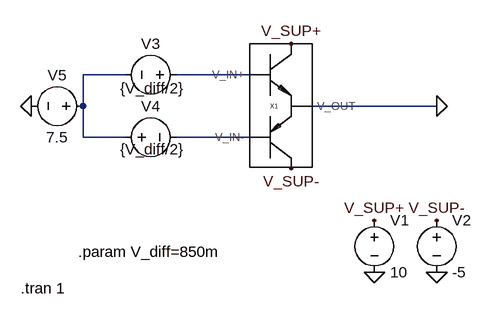
[diagram p0: schematic sim_outstage_currentlimit.asc]
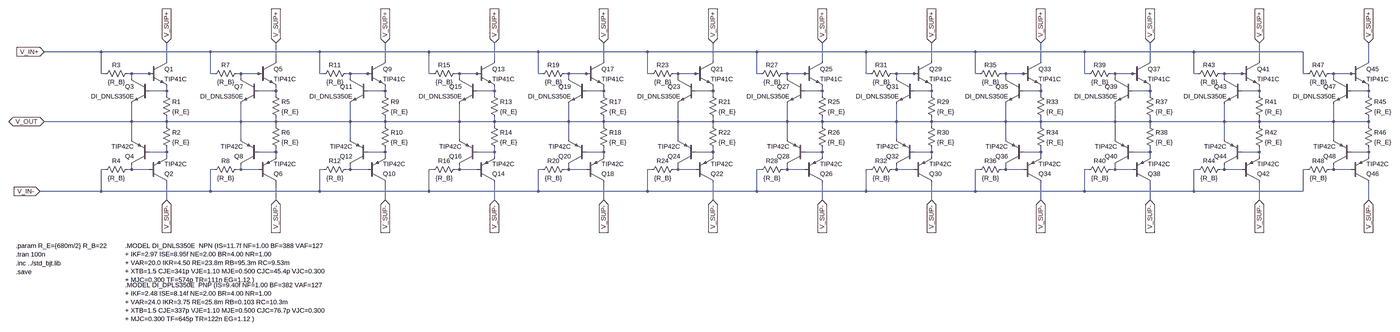
[diagram p1: sub-circuit outstage.asc, whole sheet]
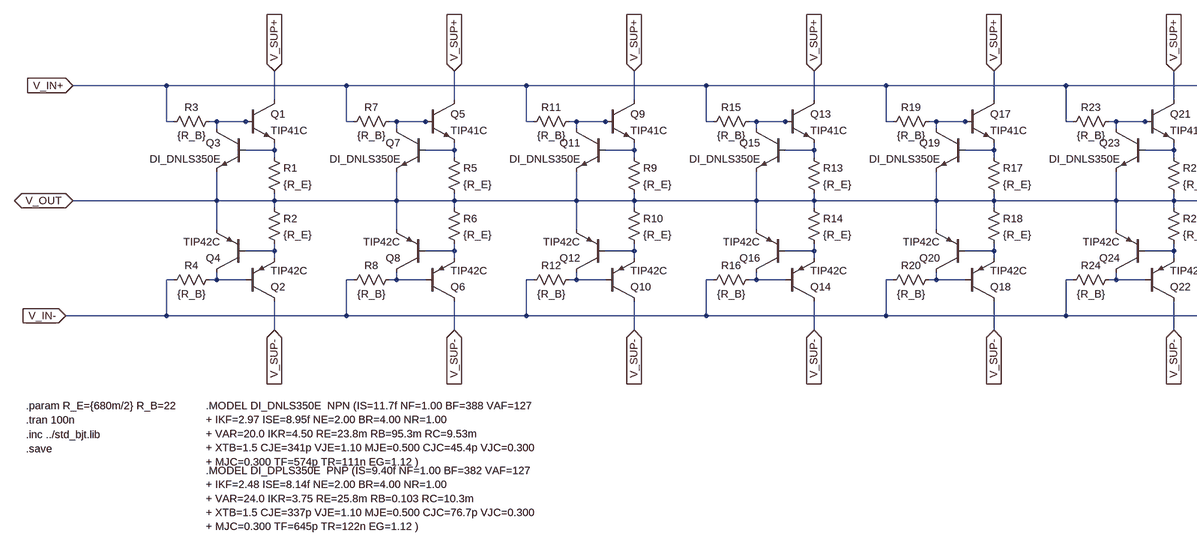
[diagram p2: sub-circuit outstage.asc, part, row 1 of 1, column 1 of 2]
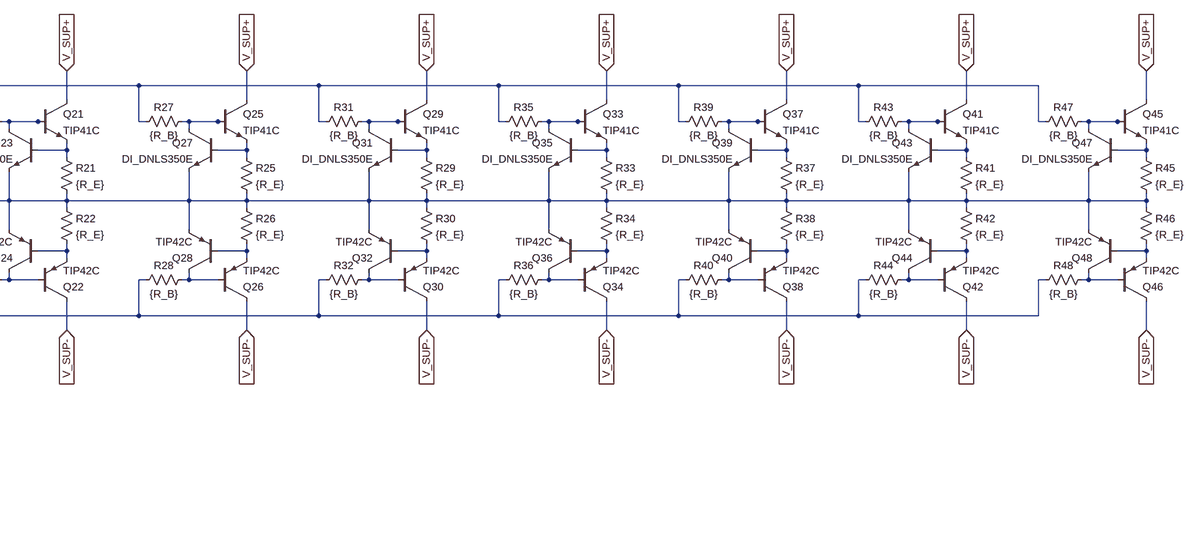
[diagram p3: sub-circuit outstage.asc, part, row 1 of 1, column 2 of 2]
sim_outstage_currentlimit.asc, the LTspice schematic file:
Version 4
SHEET 1 880 680
WIRE -64 112 -128 112
WIRE 128 112 16 112
WIRE -128 160 -128 112
WIRE 416 160 224 160
WIRE -128 208 -128 160
WIRE -64 208 -128 208
WIRE 128 208 16 208
FLAG 320 416 0
FLAG 416 416 0
FLAG 320 336 V_SUP+
FLAG 416 336 V_SUP-
FLAG 192 64 V_SUP+
FLAG 192 256 V_SUP-
FLAG -208 160 0
FLAG 416 160 0
SYMBOL outstage 160 160 R0
WINDOW 0 0 0 Left 0
SYMATTR InstName X1
SYMBOL voltage 320 320 R0
WINDOW 123 0 0 Left 0
WINDOW 39 0 0 Left 0
SYMATTR InstName V1
SYMATTR Value 10
SYMBOL voltage 416 320 R0
WINDOW 123 0 0 Left 0
WINDOW 39 0 0 Left 0
SYMATTR InstName V2
SYMATTR Value -5
SYMBOL voltage 32 112 R90
WINDOW 0 -32 56 VBottom 2
WINDOW 3 5 54 VTop 2
WINDOW 123 0 0 Left 0
WINDOW 39 0 0 Left 0
SYMATTR InstName V3
SYMATTR Value {V_diff/2}
SYMBOL voltage -80 208 R270
WINDOW 0 32 56 VTop 2
WINDOW 3 -3 58 VBottom 2
WINDOW 123 0 0 Left 0
WINDOW 39 0 0 Left 0
SYMATTR InstName V4
SYMATTR Value {V_diff/2}
SYMBOL voltage -112 160 R90
WINDOW 0 -32 56 VBottom 2
WINDOW 3 32 56 VTop 2
WINDOW 123 0 0 Left 0
WINDOW 39 0 0 Left 0
SYMATTR InstName V5
SYMATTR Value 7.5
TEXT -136 384 Left 2 !.param V_diff=850m
TEXT -224 440 Left 2 !.tran 1

outstage.asc, the sub-circuit schematic file:
Version 4
SHEET 1 5688 824
WIRE -80 -160 -288 -160
WIRE 320 -160 -80 -160
WIRE 720 -160 320 -160
WIRE 1120 -160 720 -160
WIRE 1520 -160 1120 -160
WIRE 1920 -160 1520 -160
WIRE 2320 -160 1920 -160
WIRE 2720 -160 2320 -160
WIRE 3120 -160 2720 -160
WIRE 3520 -160 3120 -160
WIRE 3920 -160 3520 -160
WIRE 4320 -160 3920 -160
WIRE 160 -128 160 -192
WIRE 560 -128 560 -192
WIRE 960 -128 960 -192
WIRE 1360 -128 1360 -192
WIRE 1760 -128 1760 -192
WIRE 2160 -128 2160 -192
WIRE 2560 -128 2560 -192
WIRE 2960 -128 2960 -192
WIRE 3360 -128 3360 -192
WIRE 3760 -128 3760 -192
WIRE 4160 -128 4160 -192
WIRE 4560 -128 4560 -192
WIRE -80 -80 -80 -160
WIRE -64 -80 -80 -80
WIRE 32 -80 16 -80
WIRE 96 -80 32 -80
WIRE 112 -80 96 -80
WIRE 320 -80 320 -160
WIRE 336 -80 320 -80
WIRE 432 -80 416 -80
WIRE 496 -80 432 -80
WIRE 512 -80 496 -80
WIRE 720 -80 720 -160
WIRE 736 -80 720 -80
WIRE 832 -80 816 -80
WIRE 896 -80 832 -80
WIRE 912 -80 896 -80
WIRE 1120 -80 1120 -160
WIRE 1136 -80 1120 -80
WIRE 1232 -80 1216 -80
WIRE 1296 -80 1232 -80
WIRE 1312 -80 1296 -80
WIRE 1520 -80 1520 -160
WIRE 1536 -80 1520 -80
WIRE 1632 -80 1616 -80
WIRE 1696 -80 1632 -80
WIRE 1712 -80 1696 -80
WIRE 1920 -80 1920 -160
WIRE 1936 -80 1920 -80
WIRE 2032 -80 2016 -80
WIRE 2096 -80 2032 -80
WIRE 2112 -80 2096 -80
WIRE 2320 -80 2320 -160
WIRE 2336 -80 2320 -80
WIRE 2432 -80 2416 -80
WIRE 2496 -80 2432 -80
WIRE 2512 -80 2496 -80
WIRE 2720 -80 2720 -160
WIRE 2736 -80 2720 -80
WIRE 2832 -80 2816 -80
WIRE 2896 -80 2832 -80
WIRE 2912 -80 2896 -80
WIRE 3120 -80 3120 -160
WIRE 3136 -80 3120 -80
WIRE 3232 -80 3216 -80
WIRE 3296 -80 3232 -80
WIRE 3312 -80 3296 -80
WIRE 3520 -80 3520 -160
WIRE 3536 -80 3520 -80
WIRE 3632 -80 3616 -80
WIRE 3696 -80 3632 -80
WIRE 3712 -80 3696 -80
WIRE 3920 -80 3920 -160
WIRE 3936 -80 3920 -80
WIRE 4032 -80 4016 -80
WIRE 4096 -80 4032 -80
WIRE 4112 -80 4096 -80
WIRE 4320 -80 4320 -160
WIRE 4336 -80 4320 -80
WIRE 4432 -80 4416 -80
WIRE 4496 -80 4432 -80
WIRE 4512 -80 4496 -80
WIRE 32 -64 32 -80
WIRE 432 -64 432 -80
WIRE 832 -64 832 -80
WIRE 1232 -64 1232 -80
WIRE 1632 -64 1632 -80
WIRE 2032 -64 2032 -80
WIRE 2432 -64 2432 -80
WIRE 2832 -64 2832 -80
WIRE 3232 -64 3232 -80
WIRE 3632 -64 3632 -80
WIRE 4032 -64 4032 -80
WIRE 4432 -64 4432 -80
WIRE 160 -16 160 -32
WIRE 160 -16 96 -16
WIRE 560 -16 560 -32
WIRE 560 -16 496 -16
WIRE 960 -16 960 -32
WIRE 960 -16 896 -16
WIRE 1360 -16 1360 -32
WIRE 1360 -16 1296 -16
WIRE 1760 -16 1760 -32
WIRE 1760 -16 1696 -16
WIRE 2160 -16 2160 -32
WIRE 2160 -16 2096 -16
WIRE 2560 -16 2560 -32
WIRE 2560 -16 2496 -16
WIRE 2960 -16 2960 -32
WIRE 2960 -16 2896 -16
WIRE 3360 -16 3360 -32
WIRE 3360 -16 3296 -16
WIRE 3760 -16 3760 -32
WIRE 3760 -16 3696 -16
WIRE 4160 -16 4160 -32
WIRE 4160 -16 4096 -16
WIRE 4560 -16 4560 -32
WIRE 4560 -16 4496 -16
WIRE 160 0 160 -16
WIRE 560 0 560 -16
WIRE 960 0 960 -16
WIRE 1360 0 1360 -16
WIRE 1760 0 1760 -16
WIRE 2160 0 2160 -16
WIRE 2560 0 2560 -16
WIRE 2960 0 2960 -16
WIRE 3360 0 3360 -16
WIRE 3760 0 3760 -16
WIRE 4160 0 4160 -16
WIRE 4560 0 4560 -16
WIRE 32 96 32 32
WIRE 32 96 -288 96
WIRE 160 96 160 80
WIRE 160 96 32 96
WIRE 432 96 432 32
WIRE 432 96 160 96
WIRE 560 96 560 80
WIRE 560 96 432 96
WIRE 832 96 832 32
WIRE 832 96 560 96
WIRE 960 96 960 80
WIRE 960 96 832 96
WIRE 1232 96 1232 32
WIRE 1232 96 960 96
WIRE 1360 96 1360 80
WIRE 1360 96 1232 96
WIRE 1632 96 1632 32
WIRE 1632 96 1360 96
WIRE 1760 96 1760 80
WIRE 1760 96 1632 96
WIRE 2032 96 2032 32
WIRE 2032 96 1760 96
WIRE 2160 96 2160 80
WIRE 2160 96 2032 96
WIRE 2432 96 2432 32
WIRE 2432 96 2160 96
WIRE 2560 96 2560 80
WIRE 2560 96 2432 96
WIRE 2832 96 2832 32
WIRE 2832 96 2560 96
WIRE 2960 96 2960 80
WIRE 2960 96 2832 96
WIRE 3232 96 3232 32
WIRE 3232 96 2960 96
WIRE 3360 96 3360 80
WIRE 3360 96 3232 96
WIRE 3632 96 3632 32
WIRE 3632 96 3360 96
WIRE 3760 96 3760 80
WIRE 3760 96 3632 96
WIRE 4032 96 4032 32
WIRE 4032 96 3760 96
WIRE 4160 96 4160 80
WIRE 4160 96 4032 96
WIRE 4432 96 4432 32
WIRE 4432 96 4160 96
WIRE 4560 96 4560 80
WIRE 4560 96 4432 96
WIRE 160 112 160 96
WIRE 560 112 560 96
WIRE 960 112 960 96
WIRE 1360 112 1360 96
WIRE 1760 112 1760 96
WIRE 2160 112 2160 96
WIRE 2560 112 2560 96
WIRE 2960 112 2960 96
WIRE 3360 112 3360 96
WIRE 3760 112 3760 96
WIRE 4160 112 4160 96
WIRE 4560 112 4560 96
WIRE 32 160 32 96
WIRE 432 160 432 96
WIRE 832 160 832 96
WIRE 1232 160 1232 96
WIRE 1632 160 1632 96
WIRE 2032 160 2032 96
WIRE 2432 160 2432 96
WIRE 2832 160 2832 96
WIRE 3232 160 3232 96
WIRE 3632 160 3632 96
WIRE 4032 160 4032 96
WIRE 4432 160 4432 96
WIRE 160 208 160 192
WIRE 160 208 96 208
WIRE 560 208 560 192
WIRE 560 208 496 208
WIRE 960 208 960 192
WIRE 960 208 896 208
WIRE 1360 208 1360 192
WIRE 1360 208 1296 208
WIRE 1760 208 1760 192
WIRE 1760 208 1696 208
WIRE 2160 208 2160 192
WIRE 2160 208 2096 208
WIRE 2560 208 2560 192
WIRE 2560 208 2496 208
WIRE 2960 208 2960 192
WIRE 2960 208 2896 208
WIRE 3360 208 3360 192
WIRE 3360 208 3296 208
WIRE 3760 208 3760 192
WIRE 3760 208 3696 208
WIRE 4160 208 4160 192
WIRE 4160 208 4096 208
WIRE 4560 208 4560 192
WIRE 4560 208 4496 208
WIRE 160 224 160 208
WIRE 560 224 560 208
WIRE 960 224 960 208
WIRE 1360 224 1360 208
WIRE 1760 224 1760 208
WIRE 2160 224 2160 208
WIRE 2560 224 2560 208
WIRE 2960 224 2960 208
WIRE 3360 224 3360 208
WIRE 3760 224 3760 208
WIRE 4160 224 4160 208
WIRE 4560 224 4560 208
WIRE -64 272 -80 272
WIRE 32 272 32 256
WIRE 32 272 16 272
WIRE 96 272 32 272
WIRE 336 272 320 272
WIRE 432 272 432 256
WIRE 432 272 416 272
WIRE 496 272 432 272
WIRE 736 272 720 272
WIRE 832 272 832 256
WIRE 832 272 816 272
WIRE 896 272 832 272
WIRE 1136 272 1120 272
WIRE 1232 272 1232 256
WIRE 1232 272 1216 272
WIRE 1296 272 1232 272
WIRE 1536 272 1520 272
WIRE 1632 272 1632 256
WIRE 1632 272 1616 272
WIRE 1696 272 1632 272
WIRE 1936 272 1920 272
WIRE 2032 272 2032 256
WIRE 2032 272 2016 272
WIRE 2096 272 2032 272
WIRE 2336 272 2320 272
WIRE 2432 272 2432 256
WIRE 2432 272 2416 272
WIRE 2496 272 2432 272
WIRE 2736 272 2720 272
WIRE 2832 272 2832 256
WIRE 2832 272 2816 272
WIRE 2896 272 2832 272
WIRE 3136 272 3120 272
WIRE 3232 272 3232 256
WIRE 3232 272 3216 272
WIRE 3296 272 3232 272
WIRE 3536 272 3520 272
WIRE 3632 272 3632 256
WIRE 3632 272 3616 272
WIRE 3696 272 3632 272
WIRE 3936 272 3920 272
WIRE 4032 272 4032 256
WIRE 4032 272 4016 272
WIRE 4096 272 4032 272
WIRE 4336 272 4320 272
WIRE 4432 272 4432 256
WIRE 4432 272 4416 272
WIRE 4496 272 4432 272
WIRE -80 352 -80 272
WIRE -80 352 -304 352
WIRE 320 352 320 272
WIRE 320 352 -80 352
WIRE 720 352 720 272
WIRE 720 352 320 352
WIRE 1120 352 1120 272
WIRE 1120 352 720 352
WIRE 1520 352 1520 272
WIRE 1520 352 1120 352
WIRE 1920 352 1920 272
WIRE 1920 352 1520 352
WIRE 2320 352 2320 272
WIRE 2320 352 1920 352
WIRE 2720 352 2720 272
WIRE 2720 352 2320 352
WIRE 3120 352 3120 272
WIRE 3120 352 2720 352
WIRE 3520 352 3520 272
WIRE 3520 352 3120 352
WIRE 3920 352 3920 272
WIRE 3920 352 3520 352
WIRE 4320 352 4320 272
WIRE 4320 352 3920 352
WIRE 160 384 160 320
WIRE 560 384 560 320
WIRE 960 384 960 320
WIRE 1360 384 1360 320
WIRE 1760 384 1760 320
WIRE 2160 384 2160 320
WIRE 2560 384 2560 320
WIRE 2960 384 2960 320
WIRE 3360 384 3360 320
WIRE 3760 384 3760 320
WIRE 4160 384 4160 320
WIRE 4560 384 4560 320
FLAG 160 -192 V_SUP+
IOPIN 160 -192 In
FLAG 160 384 V_SUP-
IOPIN 160 384 In
FLAG -288 -160 V_IN+
IOPIN -288 -160 In
FLAG -304 352 V_IN-
IOPIN -304 352 In
FLAG -288 96 V_OUT
IOPIN -288 96 BiDir
FLAG 560 -192 V_SUP+
IOPIN 560 -192 In
FLAG 560 384 V_SUP-
IOPIN 560 384 In
FLAG 960 -192 V_SUP+
IOPIN 960 -192 In
FLAG 960 384 V_SUP-
IOPIN 960 384 In
FLAG 1360 -192 V_SUP+
IOPIN 1360 -192 In
FLAG 1360 384 V_SUP-
IOPIN 1360 384 In
FLAG 1760 -192 V_SUP+
IOPIN 1760 -192 In
FLAG 1760 384 V_SUP-
IOPIN 1760 384 In
FLAG 2160 -192 V_SUP+
IOPIN 2160 -192 In
FLAG 2160 384 V_SUP-
IOPIN 2160 384 In
FLAG 2560 -192 V_SUP+
IOPIN 2560 -192 In
FLAG 2560 384 V_SUP-
IOPIN 2560 384 In
FLAG 2960 -192 V_SUP+
IOPIN 2960 -192 In
FLAG 2960 384 V_SUP-
IOPIN 2960 384 In
FLAG 3360 -192 V_SUP+
IOPIN 3360 -192 In
FLAG 3360 384 V_SUP-
IOPIN 3360 384 In
FLAG 3760 -192 V_SUP+
IOPIN 3760 -192 In
FLAG 3760 384 V_SUP-
IOPIN 3760 384 In
FLAG 4160 -192 V_SUP+
IOPIN 4160 -192 In
FLAG 4160 384 V_SUP-
IOPIN 4160 384 In
FLAG 4560 -192 V_SUP+
IOPIN 4560 -192 In
FLAG 4560 384 V_SUP-
IOPIN 4560 384 In
SYMBOL npn 96 -128 R0
SYMATTR InstName Q1
SYMATTR Value TIP41C
SYMBOL pnp 96 320 M180
SYMATTR InstName Q2
SYMATTR Value TIP42C
SYMBOL res 144 -16 R0
SYMATTR InstName R1
SYMATTR Value {R_E}
SYMBOL res 144 96 R0
SYMATTR InstName R2
SYMATTR Value {R_E}
SYMBOL npn 96 -64 M0
SYMATTR InstName Q3
SYMATTR Value DI_DNLS350E
SYMBOL res 32 -96 R90
WINDOW 0 0 56 VBottom 2
WINDOW 3 32 56 VTop 2
SYMATTR InstName R3
SYMATTR Value {R_B}
SYMBOL pnp 96 256 R180
SYMATTR InstName Q4
SYMATTR Value TIP42C
SYMBOL res 32 256 R90
WINDOW 0 0 56 VBottom 2
WINDOW 3 32 56 VTop 2
SYMATTR InstName R4
SYMATTR Value {R_B}
SYMBOL npn 496 -128 R0
SYMATTR InstName Q5
SYMATTR Value TIP41C
SYMBOL pnp 496 320 M180
SYMATTR InstName Q6
SYMATTR Value TIP42C
SYMBOL res 544 -16 R0
SYMATTR InstName R5
SYMATTR Value {R_E}
SYMBOL res 544 96 R0
SYMATTR InstName R6
SYMATTR Value {R_E}
SYMBOL npn 496 -64 M0
SYMATTR InstName Q7
SYMATTR Value DI_DNLS350E
SYMBOL res 432 -96 R90
WINDOW 0 0 56 VBottom 2
WINDOW 3 32 56 VTop 2
SYMATTR InstName R7
SYMATTR Value {R_B}
SYMBOL pnp 496 256 R180
SYMATTR InstName Q8
SYMATTR Value TIP42C
SYMBOL res 432 256 R90
WINDOW 0 0 56 VBottom 2
WINDOW 3 32 56 VTop 2
SYMATTR InstName R8
SYMATTR Value {R_B}
SYMBOL npn 896 -128 R0
SYMATTR InstName Q9
SYMATTR Value TIP41C
SYMBOL pnp 896 320 M180
SYMATTR InstName Q10
SYMATTR Value TIP42C
SYMBOL res 944 -16 R0
SYMATTR InstName R9
SYMATTR Value {R_E}
SYMBOL res 944 96 R0
SYMATTR InstName R10
SYMATTR Value {R_E}
SYMBOL npn 896 -64 M0
SYMATTR InstName Q11
SYMATTR Value DI_DNLS350E
SYMBOL res 832 -96 R90
WINDOW 0 0 56 VBottom 2
WINDOW 3 32 56 VTop 2
SYMATTR InstName R11
SYMATTR Value {R_B}
SYMBOL pnp 896 256 R180
SYMATTR InstName Q12
SYMATTR Value TIP42C
SYMBOL res 832 256 R90
WINDOW 0 0 56 VBottom 2
WINDOW 3 32 56 VTop 2
SYMATTR InstName R12
SYMATTR Value {R_B}
SYMBOL npn 1296 -128 R0
SYMATTR InstName Q13
SYMATTR Value TIP41C
SYMBOL pnp 1296 320 M180
SYMATTR InstName Q14
SYMATTR Value TIP42C
SYMBOL res 1344 -16 R0
SYMATTR InstName R13
SYMATTR Value {R_E}
SYMBOL res 1344 96 R0
SYMATTR InstName R14
SYMATTR Value {R_E}
SYMBOL npn 1296 -64 M0
SYMATTR InstName Q15
SYMATTR Value DI_DNLS350E
SYMBOL res 1232 -96 R90
WINDOW 0 0 56 VBottom 2
WINDOW 3 32 56 VTop 2
SYMATTR InstName R15
SYMATTR Value {R_B}
SYMBOL pnp 1296 256 R180
SYMATTR InstName Q16
SYMATTR Value TIP42C
SYMBOL res 1232 256 R90
WINDOW 0 0 56 VBottom 2
WINDOW 3 32 56 VTop 2
SYMATTR InstName R16
SYMATTR Value {R_B}
SYMBOL npn 1696 -128 R0
SYMATTR InstName Q17
SYMATTR Value TIP41C
SYMBOL pnp 1696 320 M180
SYMATTR InstName Q18
SYMATTR Value TIP42C
SYMBOL res 1744 -16 R0
SYMATTR InstName R17
SYMATTR Value {R_E}
SYMBOL res 1744 96 R0
SYMATTR InstName R18
SYMATTR Value {R_E}
SYMBOL npn 1696 -64 M0
SYMATTR InstName Q19
SYMATTR Value DI_DNLS350E
SYMBOL res 1632 -96 R90
WINDOW 0 0 56 VBottom 2
WINDOW 3 32 56 VTop 2
SYMATTR InstName R19
SYMATTR Value {R_B}
SYMBOL pnp 1696 256 R180
SYMATTR InstName Q20
SYMATTR Value TIP42C
SYMBOL res 1632 256 R90
WINDOW 0 0 56 VBottom 2
WINDOW 3 32 56 VTop 2
SYMATTR InstName R20
SYMATTR Value {R_B}
SYMBOL npn 2096 -128 R0
SYMATTR InstName Q21
SYMATTR Value TIP41C
SYMBOL pnp 2096 320 M180
SYMATTR InstName Q22
SYMATTR Value TIP42C
SYMBOL res 2144 -16 R0
SYMATTR InstName R21
SYMATTR Value {R_E}
SYMBOL res 2144 96 R0
SYMATTR InstName R22
SYMATTR Value {R_E}
SYMBOL npn 2096 -64 M0
SYMATTR InstName Q23
SYMATTR Value DI_DNLS350E
SYMBOL res 2032 -96 R90
WINDOW 0 0 56 VBottom 2
WINDOW 3 32 56 VTop 2
SYMATTR InstName R23
SYMATTR Value {R_B}
SYMBOL pnp 2096 256 R180
SYMATTR InstName Q24
SYMATTR Value TIP42C
SYMBOL res 2032 256 R90
WINDOW 0 0 56 VBottom 2
WINDOW 3 32 56 VTop 2
SYMATTR InstName R24
SYMATTR Value {R_B}
SYMBOL npn 2496 -128 R0
SYMATTR InstName Q25
SYMATTR Value TIP41C
SYMBOL pnp 2496 320 M180
SYMATTR InstName Q26
SYMATTR Value TIP42C
SYMBOL res 2544 -16 R0
SYMATTR InstName R25
SYMATTR Value {R_E}
SYMBOL res 2544 96 R0
SYMATTR InstName R26
SYMATTR Value {R_E}
SYMBOL npn 2496 -64 M0
SYMATTR InstName Q27
SYMATTR Value DI_DNLS350E
SYMBOL res 2432 -96 R90
WINDOW 0 0 56 VBottom 2
WINDOW 3 32 56 VTop 2
SYMATTR InstName R27
SYMATTR Value {R_B}
SYMBOL pnp 2496 256 R180
SYMATTR InstName Q28
SYMATTR Value TIP42C
SYMBOL res 2432 256 R90
WINDOW 0 0 56 VBottom 2
WINDOW 3 32 56 VTop 2
SYMATTR InstName R28
SYMATTR Value {R_B}
SYMBOL npn 2896 -128 R0
SYMATTR InstName Q29
SYMATTR Value TIP41C
SYMBOL pnp 2896 320 M180
SYMATTR InstName Q30
SYMATTR Value TIP42C
SYMBOL res 2944 -16 R0
SYMATTR InstName R29
SYMATTR Value {R_E}
SYMBOL res 2944 96 R0
SYMATTR InstName R30
SYMATTR Value {R_E}
SYMBOL npn 2896 -64 M0
SYMATTR InstName Q31
SYMATTR Value DI_DNLS350E
SYMBOL res 2832 -96 R90
WINDOW 0 0 56 VBottom 2
WINDOW 3 32 56 VTop 2
SYMATTR InstName R31
SYMATTR Value {R_B}
SYMBOL pnp 2896 256 R180
SYMATTR InstName Q32
SYMATTR Value TIP42C
SYMBOL res 2832 256 R90
WINDOW 0 0 56 VBottom 2
WINDOW 3 32 56 VTop 2
SYMATTR InstName R32
SYMATTR Value {R_B}
SYMBOL npn 3296 -128 R0
SYMATTR InstName Q33
SYMATTR Value TIP41C
SYMBOL pnp 3296 320 M180
SYMATTR InstName Q34
SYMATTR Value TIP42C
SYMBOL res 3344 -16 R0
SYMATTR InstName R33
SYMATTR Value {R_E}
SYMBOL res 3344 96 R0
SYMATTR InstName R34
SYMATTR Value {R_E}
SYMBOL npn 3296 -64 M0
SYMATTR InstName Q35
SYMATTR Value DI_DNLS350E
SYMBOL res 3232 -96 R90
WINDOW 0 0 56 VBottom 2
WINDOW 3 32 56 VTop 2
SYMATTR InstName R35
SYMATTR Value {R_B}
SYMBOL pnp 3296 256 R180
SYMATTR InstName Q36
SYMATTR Value TIP42C
SYMBOL res 3232 256 R90
WINDOW 0 0 56 VBottom 2
WINDOW 3 32 56 VTop 2
SYMATTR InstName R36
SYMATTR Value {R_B}
SYMBOL npn 3696 -128 R0
SYMATTR InstName Q37
SYMATTR Value TIP41C
SYMBOL pnp 3696 320 M180
SYMATTR InstName Q38
SYMATTR Value TIP42C
SYMBOL res 3744 -16 R0
SYMATTR InstName R37
SYMATTR Value {R_E}
SYMBOL res 3744 96 R0
SYMATTR InstName R38
SYMATTR Value {R_E}
SYMBOL npn 3696 -64 M0
SYMATTR InstName Q39
SYMATTR Value DI_DNLS350E
SYMBOL res 3632 -96 R90
WINDOW 0 0 56 VBottom 2
WINDOW 3 32 56 VTop 2
SYMATTR InstName R39
SYMATTR Value {R_B}
SYMBOL pnp 3696 256 R180
SYMATTR InstName Q40
SYMATTR Value TIP42C
SYMBOL res 3632 256 R90
WINDOW 0 0 56 VBottom 2
WINDOW 3 32 56 VTop 2
SYMATTR InstName R40
SYMATTR Value {R_B}
SYMBOL npn 4096 -128 R0
SYMATTR InstName Q41
SYMATTR Value TIP41C
SYMBOL pnp 4096 320 M180
SYMATTR InstName Q42
SYMATTR Value TIP42C
SYMBOL res 4144 -16 R0
SYMATTR InstName R41
SYMATTR Value {R_E}
SYMBOL res 4144 96 R0
SYMATTR InstName R42
SYMATTR Value {R_E}
SYMBOL npn 4096 -64 M0
SYMATTR InstName Q43
SYMATTR Value DI_DNLS350E
SYMBOL res 4032 -96 R90
WINDOW 0 0 56 VBottom 2
WINDOW 3 32 56 VTop 2
SYMATTR InstName R43
SYMATTR Value {R_B}
SYMBOL pnp 4096 256 R180
SYMATTR InstName Q44
SYMATTR Value TIP42C
SYMBOL res 4032 256 R90
WINDOW 0 0 56 VBottom 2
WINDOW 3 32 56 VTop 2
SYMATTR InstName R44
SYMATTR Value {R_B}
SYMBOL npn 4496 -128 R0
SYMATTR InstName Q45
SYMATTR Value TIP41C
SYMBOL pnp 4496 320 M180
SYMATTR InstName Q46
SYMATTR Value TIP42C
SYMBOL res 4544 -16 R0
SYMATTR InstName R45
SYMATTR Value {R_E}
SYMBOL res 4544 96 R0
SYMATTR InstName R46
SYMATTR Value {R_E}
SYMBOL npn 4496 -64 M0
SYMATTR InstName Q47
SYMATTR Value DI_DNLS350E
SYMBOL res 4432 -96 R90
WINDOW 0 0 56 VBottom 2
WINDOW 3 32 56 VTop 2
SYMATTR InstName R47
SYMATTR Value {R_B}
SYMBOL pnp 4496 256 R180
SYMATTR InstName Q48
SYMATTR Value TIP42C
SYMBOL res 4432 256 R90
WINDOW 0 0 56 VBottom 2
WINDOW 3 32 56 VTop 2
SYMATTR InstName R48
SYMATTR Value {R_B}
TEXT -392 616 Left 2 !.inc ../std_bjt.lib
TEXT -392 584 Left 2 !.tran 100n
TEXT -392 552 Left 2 !.param R_E={680m/2} R_B=22
TEXT -392 648 Left 2 !.save
TEXT 8 552 Left 2 !.MODEL DI_DNLS350E  NPN (IS=11.7f NF=1.00 BF=388 VAF=127\n+ IKF=2.97 ISE=8.95f NE=2.00 BR=4.00 NR=1.00\n+ VAR=20.0 IKR=4.50 RE=23.8m RB=95.3m RC=9.53m\n+ XTB=1.5 CJE=341p VJE=1.10 MJE=0.500 CJC=45.4p VJC=0.300\n+ MJC=0.300 TF=574p TR=111n EG=1.12 )
TEXT 8 696 Left 2 !.MODEL DI_DPLS350E  PNP (IS=9.40f NF=1.00 BF=382 VAF=127\n+ IKF=2.48 ISE=8.14f NE=2.00 BR=4.00 NR=1.00\n+ VAR=24.0 IKR=3.75 RE=25.8m RB=0.103 RC=10.3m\n+ XTB=1.5 CJE=337p VJE=1.10 MJE=0.500 CJC=76.7p VJC=0.300\n+ MJC=0.300 TF=645p TR=122n EG=1.12 )

The netlist it stands for:
* sim_outstage_currentlimit.asc
XX1 V_SUP+ V_SUP- N002 N003 0 outstage
V1 V_SUP+ 0 10
V2 V_SUP- 0 -5
V3 N002 N001 {V_diff/2}
V4 N001 N003 {V_diff/2}
V5 N001 0 7.5

* block symbol definitions
.subckt outstage V_SUP+ V_SUP- V_IN+ V_IN- V_OUT
Q1 V_SUP+ N001 N013 0 TIP41C
Q2 V_SUP- N037 N025 0 TIP42C
R1 N013 V_OUT {R_E}
R2 V_OUT N025 {R_E}
Q3 N001 N013 V_OUT 0 DI_DNLS350E
R3 N001 V_IN+ {R_B}
Q4 N037 N025 V_OUT 0 TIP42C
R4 N037 V_IN- {R_B}
Q5 V_SUP+ N002 N014 0 TIP41C
Q6 V_SUP- N038 N026 0 TIP42C
R5 N014 V_OUT {R_E}
R6 V_OUT N026 {R_E}
Q7 N002 N014 V_OUT 0 DI_DNLS350E
R7 N002 V_IN+ {R_B}
Q8 N038 N026 V_OUT 0 TIP42C
R8 N038 V_IN- {R_B}
Q9 V_SUP+ N003 N015 0 TIP41C
Q10 V_SUP- N039 N027 0 TIP42C
R9 N015 V_OUT {R_E}
R10 V_OUT N027 {R_E}
Q11 N003 N015 V_OUT 0 DI_DNLS350E
R11 N003 V_IN+ {R_B}
Q12 N039 N027 V_OUT 0 TIP42C
R12 N039 V_IN- {R_B}
Q13 V_SUP+ N004 N016 0 TIP41C
Q14 V_SUP- N040 N028 0 TIP42C
R13 N016 V_OUT {R_E}
R14 V_OUT N028 {R_E}
Q15 N004 N016 V_OUT 0 DI_DNLS350E
R15 N004 V_IN+ {R_B}
Q16 N040 N028 V_OUT 0 TIP42C
R16 N040 V_IN- {R_B}
Q17 V_SUP+ N005 N017 0 TIP41C
Q18 V_SUP- N041 N029 0 TIP42C
R17 N017 V_OUT {R_E}
R18 V_OUT N029 {R_E}
Q19 N005 N017 V_OUT 0 DI_DNLS350E
R19 N005 V_IN+ {R_B}
Q20 N041 N029 V_OUT 0 TIP42C
R20 N041 V_IN- {R_B}
Q21 V_SUP+ N006 N018 0 TIP41C
Q22 V_SUP- N042 N030 0 TIP42C
R21 N018 V_OUT {R_E}
R22 V_OUT N030 {R_E}
Q23 N006 N018 V_OUT 0 DI_DNLS350E
R23 N006 V_IN+ {R_B}
Q24 N042 N030 V_OUT 0 TIP42C
R24 N042 V_IN- {R_B}
Q25 V_SUP+ N007 N019 0 TIP41C
Q26 V_SUP- N043 N031 0 TIP42C
R25 N019 V_OUT {R_E}
R26 V_OUT N031 {R_E}
Q27 N007 N019 V_OUT 0 DI_DNLS350E
R27 N007 V_IN+ {R_B}
Q28 N043 N031 V_OUT 0 TIP42C
R28 N043 V_IN- {R_B}
Q29 V_SUP+ N008 N020 0 TIP41C
Q30 V_SUP- N044 N032 0 TIP42C
R29 N020 V_OUT {R_E}
R30 V_OUT N032 {R_E}
Q31 N008 N020 V_OUT 0 DI_DNLS350E
R31 N008 V_IN+ {R_B}
Q32 N044 N032 V_OUT 0 TIP42C
R32 N044 V_IN- {R_B}
Q33 V_SUP+ N009 N021 0 TIP41C
Q34 V_SUP- N045 N033 0 TIP42C
R33 N021 V_OUT {R_E}
R34 V_OUT N033 {R_E}
Q35 N009 N021 V_OUT 0 DI_DNLS350E
R35 N009 V_IN+ {R_B}
Q36 N045 N033 V_OUT 0 TIP42C
R36 N045 V_IN- {R_B}
Q37 V_SUP+ N010 N022 0 TIP41C
Q38 V_SUP- N046 N034 0 TIP42C
R37 N022 V_OUT {R_E}
R38 V_OUT N034 {R_E}
Q39 N010 N022 V_OUT 0 DI_DNLS350E
R39 N010 V_IN+ {R_B}
Q40 N046 N034 V_OUT 0 TIP42C
R40 N046 V_IN- {R_B}
Q41 V_SUP+ N011 N023 0 TIP41C
Q42 V_SUP- N047 N035 0 TIP42C
R41 N023 V_OUT {R_E}
R42 V_OUT N035 {R_E}
Q43 N011 N023 V_OUT 0 DI_DNLS350E
R43 N011 V_IN+ {R_B}
Q44 N047 N035 V_OUT 0 TIP42C
R44 N047 V_IN- {R_B}
Q45 V_SUP+ N012 N024 0 TIP41C
Q46 V_SUP- N048 N036 0 TIP42C
R45 N024 V_OUT {R_E}
R46 V_OUT N036 {R_E}
Q47 N012 N024 V_OUT 0 DI_DNLS350E
R47 N012 V_IN+ {R_B}
Q48 N048 N036 V_OUT 0 TIP42C
R48 N048 V_IN- {R_B}
.inc ../std_bjt.lib
.tran 100n
.param R_E={680m/2} R_B=22
.save
.MODEL DI_DNLS350E  NPN (IS=11.7f NF=1.00 BF=388 VAF=127
+ IKF=2.97 ISE=8.95f NE=2.00 BR=4.00 NR=1.00
+ VAR=20.0 IKR=4.50 RE=23.8m RB=95.3m RC=9.53m
+ XTB=1.5 CJE=341p VJE=1.10 MJE=0.500 CJC=45.4p VJC=0.300
+ MJC=0.300 TF=574p TR=111n EG=1.12 )
.MODEL DI_DPLS350E  PNP (IS=9.40f NF=1.00 BF=382 VAF=127
+ IKF=2.48 ISE=8.14f NE=2.00 BR=4.00 NR=1.00
+ VAR=24.0 IKR=3.75 RE=25.8m RB=0.103 RC=10.3m
+ XTB=1.5 CJE=337p VJE=1.10 MJE=0.500 CJC=76.7p VJC=0.300
+ MJC=0.300 TF=645p TR=122n EG=1.12 )
.ends outstage

.model NPN NPN
.model PNP PNP
.lib standard.bjt
.param V_diff=850m
.tran 1
.backanno
.end